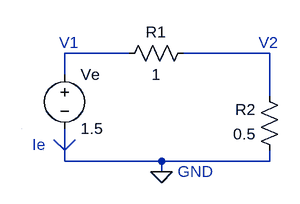
[diagram p0: schematic test_circuit_2.asc]
test_circuit_2.asc, the LTspice schematic file:
Version 4
SHEET 1 880 680
WIRE 16 112 -80 112
WIRE 224 112 96 112
WIRE -80 144 -80 112
WIRE 224 176 224 112
WIRE -80 272 -80 224
WIRE 64 272 -80 272
WIRE 224 272 224 256
WIRE 224 272 64 272
WIRE 64 288 64 272
FLAG 64 288 0
SYMBOL res 112 96 R90
WINDOW 0 0 56 VBottom 2
WINDOW 3 32 56 VTop 2
SYMATTR InstName R1
SYMATTR Value 1
SYMBOL res 240 272 R180
WINDOW 0 36 76 Left 2
WINDOW 3 36 40 Left 2
SYMATTR InstName R2
SYMATTR Value 0.5
SYMBOL voltage -80 128 R0
WINDOW 123 0 0 Left 0
WINDOW 39 0 0 Left 0
SYMATTR InstName Ve
SYMATTR Value 1.5
TEXT 208 96 Left 2 ;V2
TEXT 88 288 Left 2 ;GND
TEXT -128 248 Left 2 ;Ie
TEXT -88 96 Left 2 ;V1
LINE Normal -112 256 -112 256 2
LINE Normal -144 224 -144 224 2
LINE Normal -96 240 -80 256
LINE Normal -80 256 -96 240
LINE Normal -64 240 -80 256

The netlist it stands for:
* test_circuit_2.asc
R1 N002 N001 1
R2 0 N002 0.5
Ve N001 0 1.5
* V2
* GND
* Ie
* V1
.backanno
.end